# EAGLE design AGM8331 (EAGLE 7.4.0)
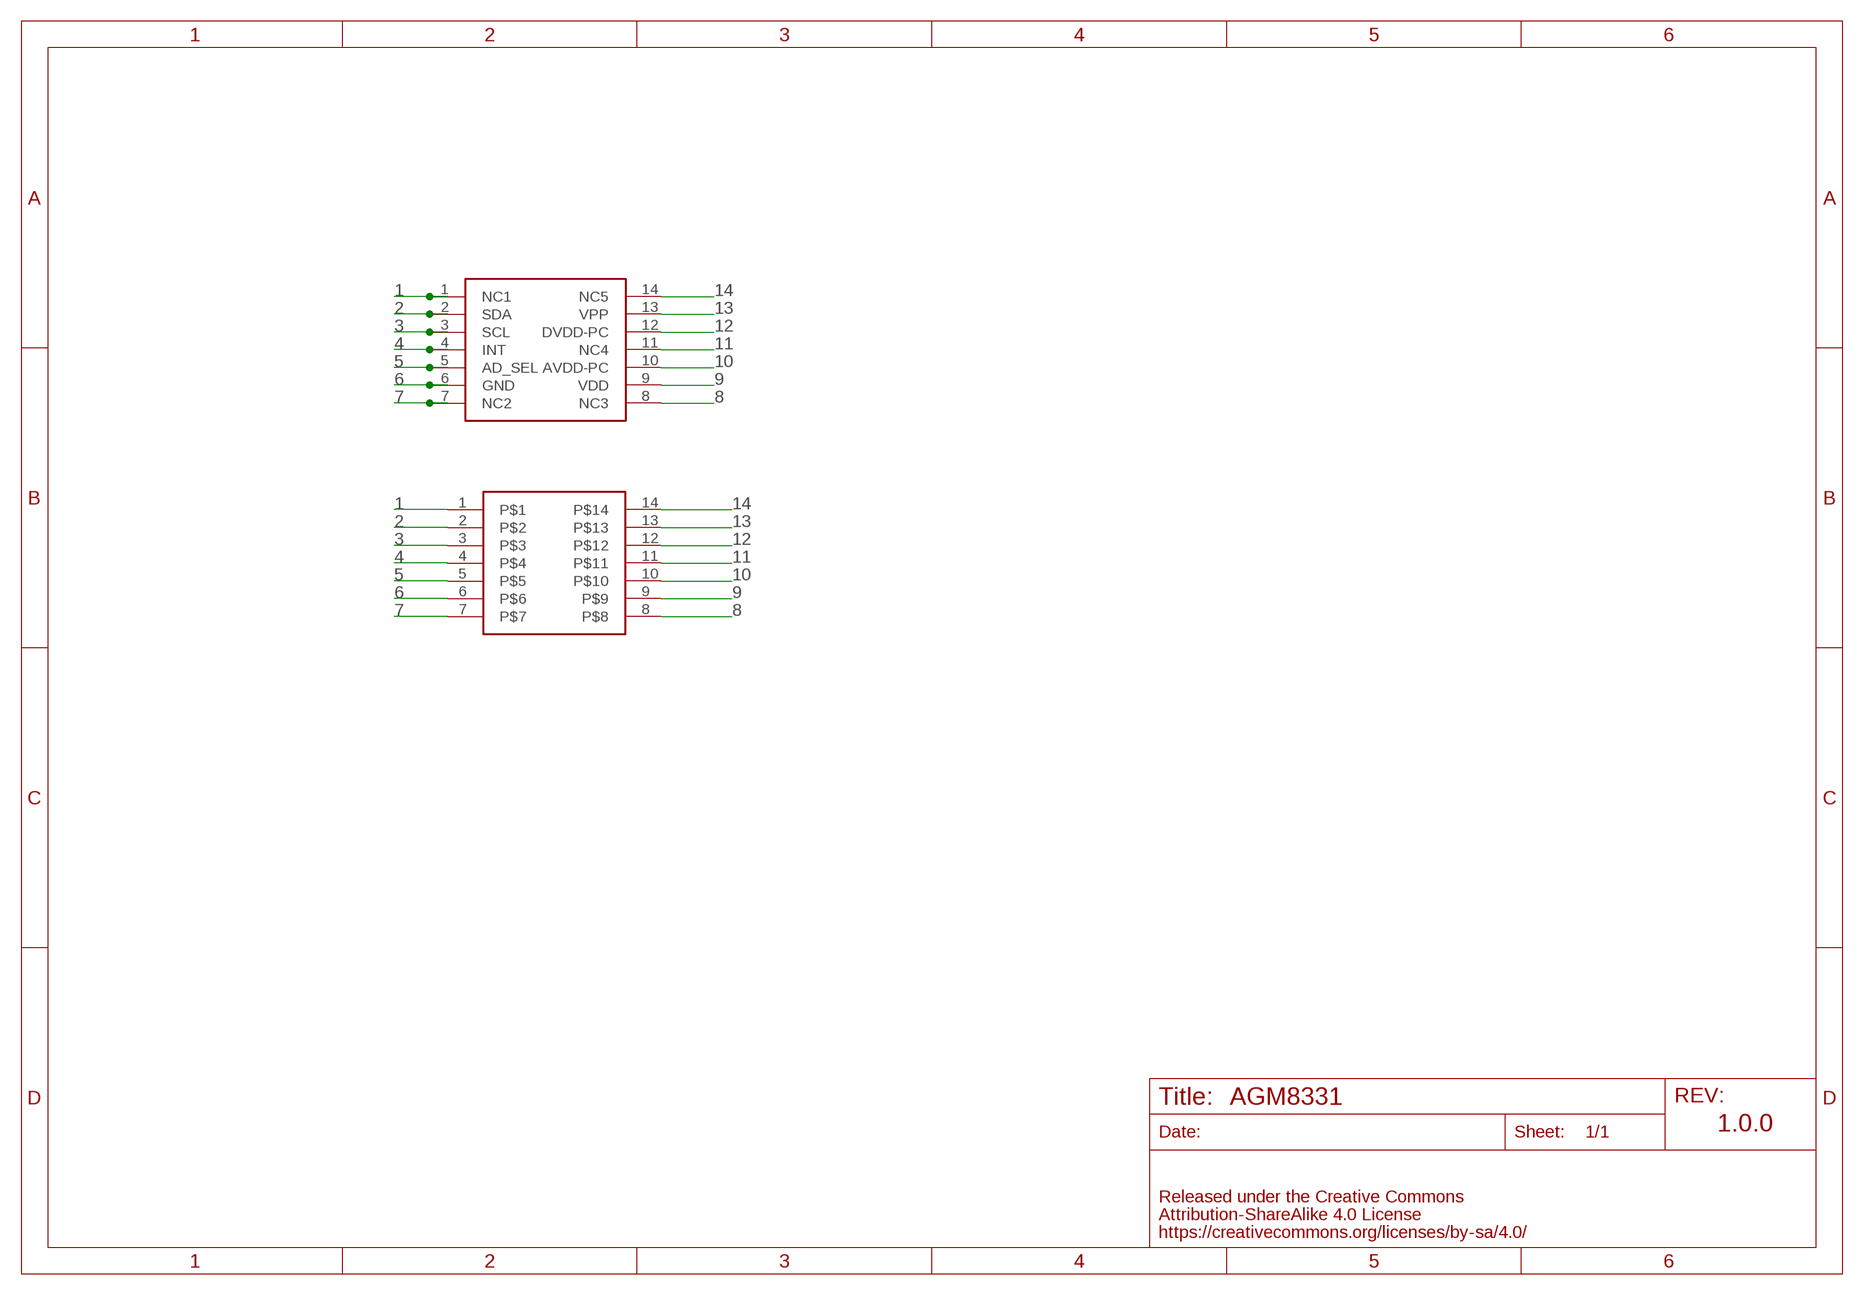
[diagram p0: schematic, sheet 1]

## Parts
U$2  14PINWIDE  [14PIN-WIDE]
U$3  PN-AMG8331  [PANASONIC-AMG8831]

## Nets
1: U$2.1 U$3.1(NC1)
2: U$2.2 U$3.2(SDA)
3: U$2.3 U$3.3(SCL)
4: U$2.4 U$3.4(INT)
5: U$2.5 U$3.5(AD_SEL)
6: U$2.6 U$3.6(GND)
7: U$2.7 U$3.7(NC2)
8: U$2.8 U$3.8(NC3)
9: U$2.9 U$3.9(VDD)
10: U$2.10 U$3.10(AVDD-PC)
11: U$2.11 U$3.11(NC4)
12: U$2.12 U$3.12(DVDD-PC)
13: U$2.13 U$3.13(VPP)
14: U$2.14 U$3.14(NC5)

## Notes on the sheet
- 1.0.0

## Library data of the parts
U$2 = FaBo-Breakout:14PIN
U$3 = FaBo-Mems:PN-AMG8331

## Board
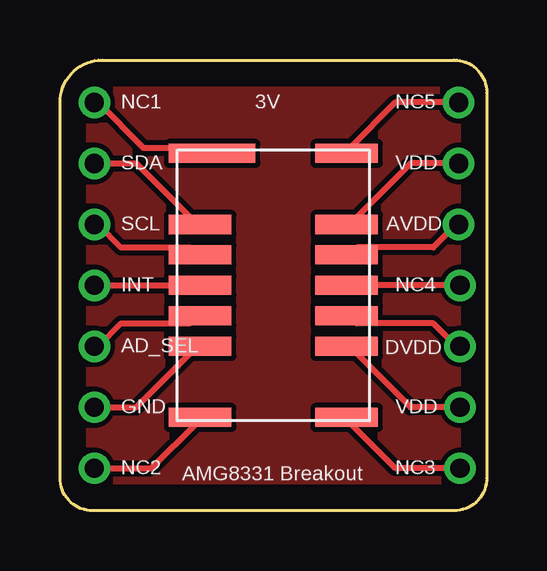
[diagram p1: board, top side]
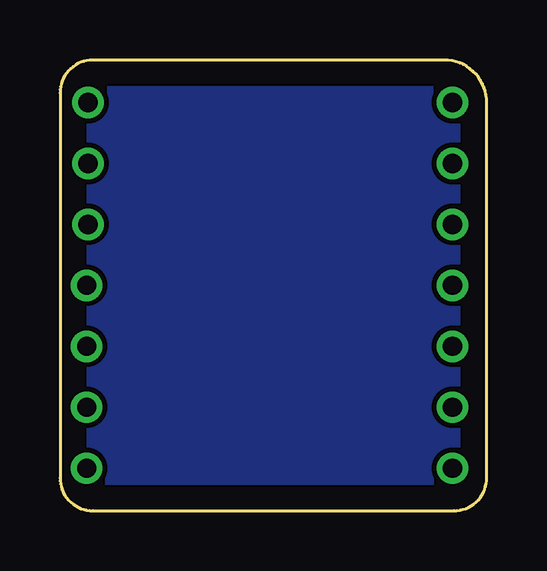
[diagram p2: board, bottom side, seen from below]

Size 17.78 x 18.78 mm. Coordinates in mm from the lower left corner, seen from the top.
Copper layers (1*16): Top 0.035mm / dielectric 1.5mm / Bottom 0.035mm
Design rules "default": minimum track width 10mil, minimum drill 24mil, track to track 8mil, track to pad 8mil, pad to pad 8mil, via to via 8mil, smd to smd 8mil, copper to edge 40mil, drill to drill 8mil, minimum pad ring 10mil, minimum via ring 8mil, stop-mask expansion 4mil, vias tented up to drill 0mil, thermal gap 10mil

### Footprints (pad centres in the part's own frame; a part is rotated, then mirrored left to right if it is on the bottom)
14PIN-WIDE = drill 0.8: 1 -7.46,7.62; 2 -7.46,5.08; 3 -7.46,2.54; 4 -7.46,0; 5 -7.46,-2.54; 6 -7.46,-5.08; 7 -7.46,-7.62; 8 7.78,-7.62; 9 7.78,-5.08; 10 7.78,-2.54; 11 7.78,0; 12 7.72,2.54; 13 7.72,5.08; 14 7.72,7.62
PANASONIC-AMG8831 = smd 0.8 x 3.6: 1 -5.5,-2.55 | smd 0.8 x 2.6: 2 -2.54,-3.05; 3 -1.27,-3.05; 4 0,-3.05; 5 1.27,-3.05; 6 2.54,-3.05; 7 5.5,-3.05; 8 5.5,3.05; 9 2.54,3.05; 10 1.27,3.05; 11 0,3.05; 12 -1.27,3.05; 13 -2.54,3.05; 14 -5.5,3.05

### Placement (x,y rotation side)
U$2  8.89,9.39 0 top
U$3  8.89,9.39 270 top

### Tracks (layer width: path | path; a pad name or v marks a point on that pad's centre or on a via)
1
  Top 0.254: U$2.1 1.59,17.01 3.49,15.11 6.03,15.11 U$3.1
2
  Top 0.254: U$2.2 3.18,14.47 5.72,11.93 U$3.2
3
  Top 0.254: U$3.3 5.72,10.66 5.4,10.98 2.54,10.98 1.59,11.93 U$2.3
4
  Top 0.254: U$2.4 U$3.4
5
  Top 0.254: U$3.5 5.72,8.12 5.4,7.8 2.54,7.8 1.59,6.85 U$2.5
6
  Top 0.254: U$2.6 3.18,4.31 5.72,6.85 U$3.6
7
  Top 0.254: U$2.7 3.81,1.77 5.72,3.68 U$3.7
8
  Top 0.254: U$2.8 13.97,1.77 12.07,3.68 U$3.8
9
  Top 0.254: U$2.9 14.61,4.31 12.07,6.85 U$3.9
10
  Top 0.254: U$3.10 12.07,8.12 12.38,7.8 15.56,7.8 16.51,6.85 U$2.10
11
  Top 0.254: U$2.11 U$3.11
12
  Top 0.254: U$3.12 12.07,10.66 12.38,10.98 15.56,10.98 16.51,11.93 U$2.12
13
  Top 0.254: U$2.13 14.61,14.47 12.07,11.93 U$3.13
14
  Top 0.254: U$2.14 13.97,17.01 12.07,15.11 U$3.14
GND
  pour Bottom: -0.25,-0.26 18.03,-0.26 18.03,18.79 -0.25,18.79 -0.25,-0.01
N$1
  pour Top: -0.25,-0.26 18.03,-0.26 18.03,18.79 -0.25,18.79

### Text on the board
tPlace: NC1 | 3V | NC5 | SDA | VDD | SCL | AVDD | INT | NC4 | AD_SEL | DVDD | GND | VDD | NC2 | AMG8331 Breakout | NC3